# EAGLE design UmnitsaUltrasonic (EAGLE 9.3.0)
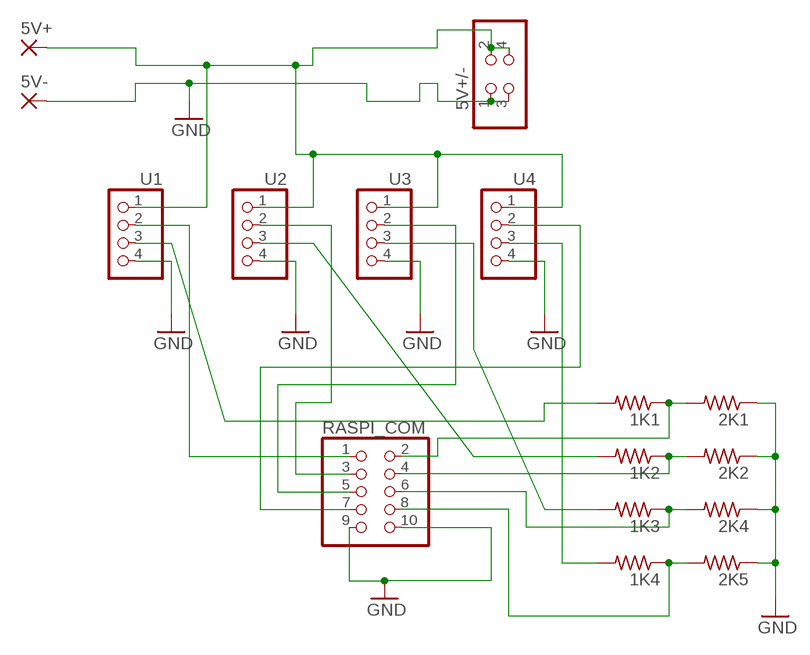
[diagram p0: schematic, sheet 1]

## Parts
1K1  R-US_0204/7  [0204/7]
1K2  R-US_0204/7  [0204/7]
1K3  R-US_0204/7  [0204/7]
1K4  R-US_0204/7  [0204/7]
2K1  R-US_0204/7  [0204/7]
2K2  R-US_0204/7  [0204/7]
2K4  R-US_0204/7  [0204/7]
2K5  R-US_0204/7  [0204/7]
5V+  3,17/1,3  [3,17/1,3]
5V+/-  PINHD-2X2  [2X02]
5V-  3,17/1,3  [3,17/1,3]
RASPI_COM  PINHD-2X5  [2X05]
U1  PINHD-1X4  [1X04]
U2  PINHD-1X4  [1X04]
U3  PINHD-1X4  [1X04]
U4  PINHD-1X4  [1X04]

## Nets
GND [Power]: 2K1.1 2K2.1 2K4.1 2K5.1 5V+/-.1 5V+/-.3 5V-.1(P) RASPI_COM.9 RASPI_COM.10 U1.4 U2.4 U3.4 U4.4
N$1: 1K4.2 U4.3
N$2: 1K3.2 U3.3
N$3: 1K1.1 2K1.2 RASPI_COM.2
N$4: 1K2.1 2K2.2 RASPI_COM.4
N$5: 1K3.1 2K4.2 RASPI_COM.6
N$6 [Power]: 5V+.1(P) 5V+/-.2 5V+/-.4 U1.1 U2.1 U3.1 U4.1
N$7: 1K4.1 2K5.2 RASPI_COM.8
N$8: RASPI_COM.1 U1.2
N$9: RASPI_COM.3 U2.2
N$10: RASPI_COM.5 U3.2
N$11: RASPI_COM.7 U4.2
N$12: 1K2.2 U2.3
N$13: 1K1.2 U1.3

## Library data of the parts
1K1-1K4 2K1 2K2 2K4 2K5 = resistor:R-US_: RESISTOR, American symbol
5V+ 5V- = wirepad:3,17/1,3: THROUGH-HOLE PAD
5V+/- = pinhead:PINHD-2X2: PIN HEADER
RASPI_COM = pinhead:PINHD-2X5: PIN HEADER
U1-U4 = pinhead:PINHD-1X4: PIN HEADER

## Net classes
0 default: width 0.406 mm, clearance 0.457 mm
1 Power: width 1.016 mm, clearance 0.457 mm

## Board
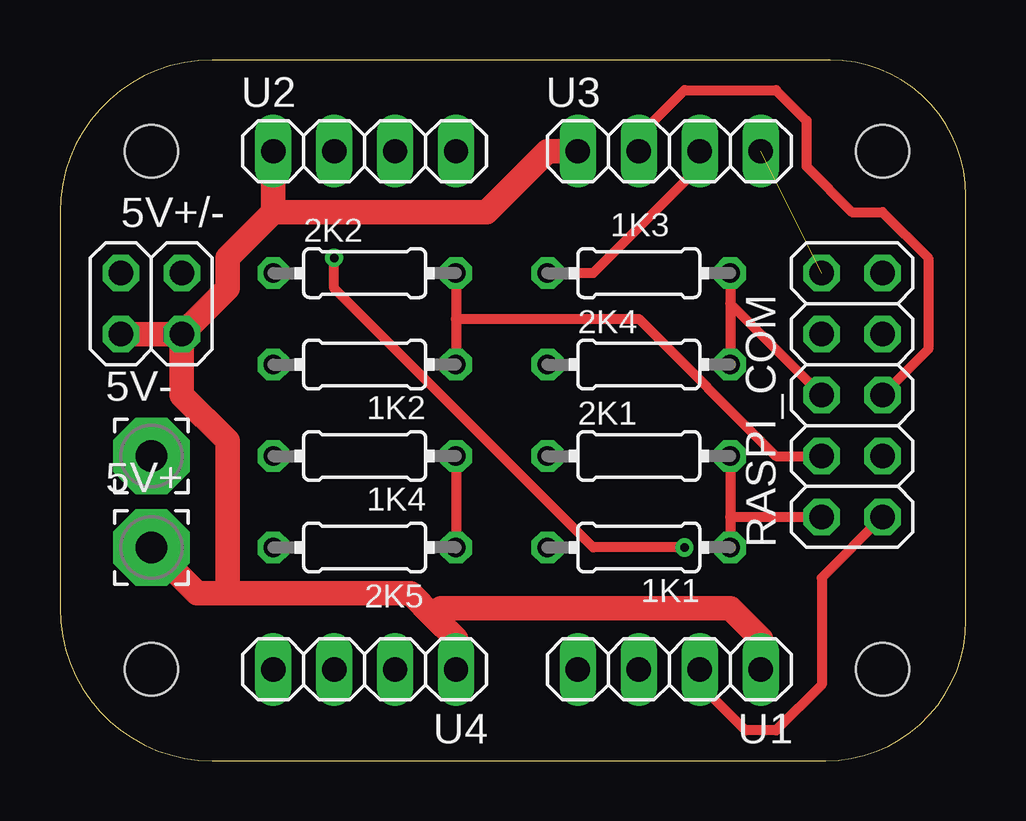
[diagram p1: board, top side]
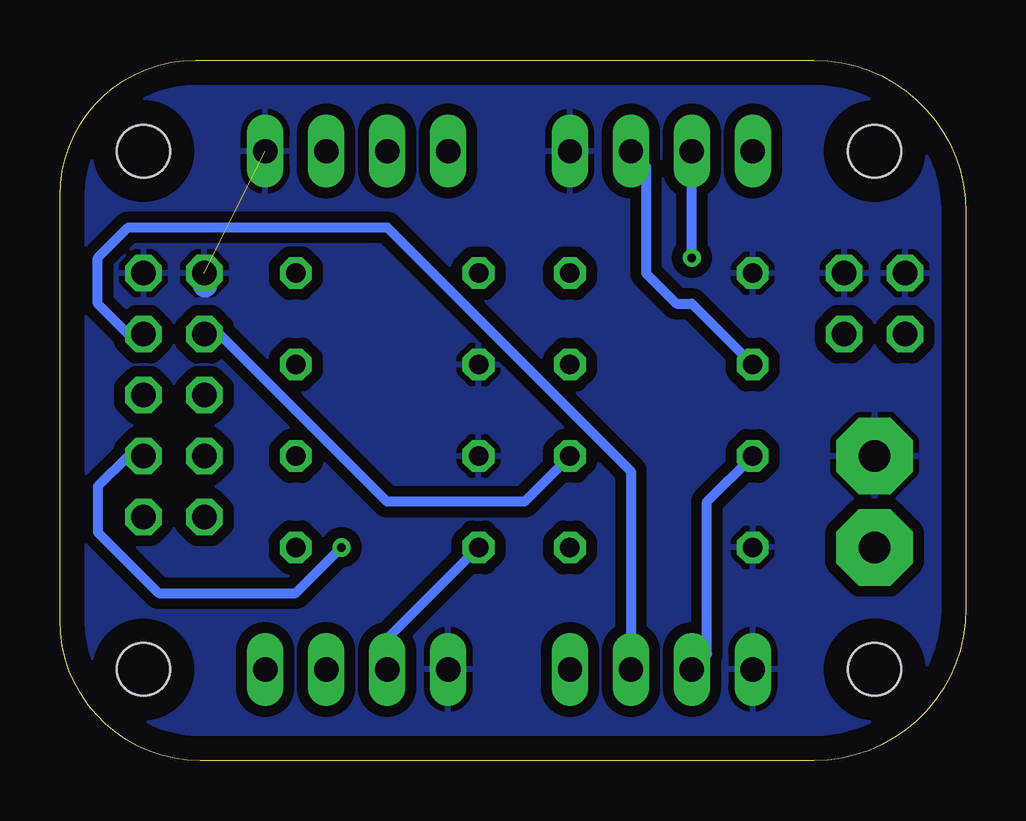
[diagram p2: board, bottom side, seen from below]

Size 37.77 x 29.2 mm. Coordinates in mm from the lower left corner, seen from the top.
Outline: 0,22.87 0,6.35 arc90 6.35,0 31.92,0 arc90 37.77,5.85 37.77,23.55 arc90 32.12,29.2 6.34,29.2 arc90 0,22.87
Copper layers (1*16): Top 0.035mm / dielectric 1.5mm / Bottom 0.035mm
Design rules "default": minimum track width 6mil, minimum drill 0.35mm, track to track 6mil, track to pad 6mil, pad to pad 6mil, via to via 6mil, smd to smd 6mil, copper to edge 40mil, drill to drill 6mil, minimum pad ring 10mil, minimum via ring 8mil, stop-mask expansion 4mil, vias tented up to drill 0mil, thermal gap 10mil
Holes 2.2 mm at 3.81,3.81 3.81,25.4 34.29,3.81 34.29,25.4

### Footprints (pad centres in the part's own frame; a part is rotated, then mirrored left to right if it is on the bottom)
0204/7 = drill 0.813 octagon: 1 -3.81,0; 2 3.81,0
3,17/1,3 = drill 1.321 pad 3.175 octagon: 1 0,0
2X02 = drill 1.016 octagon: 1 -1.27,-1.27; 2 -1.27,1.27; 3 1.27,-1.27; 4 1.27,1.27
2X05 = drill 1.016 octagon: 1 -5.08,-1.27; 2 -5.08,1.27; 3 -2.54,-1.27; 4 -2.54,1.27; 5 0,-1.27; 6 0,1.27; 7 2.54,-1.27; 8 2.54,1.27; 9 5.08,-1.27; 10 5.08,1.27
1X04 = drill 1.016 long: 1 -3.81,0; 2 -1.27,0; 3 1.27,0; 4 3.81,0

### Placement (x,y rotation side)
1K1  24.13,8.89 180 top
1K2  12.7,16.51 180 top
1K3  24.13,20.32 180 top
1K4  12.7,12.7 180 top
2K1  24.13,12.7 0 top
2K2  12.7,20.32 0 top
2K4  24.13,16.51 0 top
2K5  12.7,8.89 0 top
5V+  3.81,8.89 0 top
5V+/-  3.81,19.05 180 top
5V-  3.81,12.7 0 top
RASPI_COM  33.02,15.24 90 top
U1  25.4,3.81 180 top
U2  12.7,25.4 0 top
U3  25.4,25.4 0 top
U4  12.7,3.81 180 top

### Tracks (layer width: path | path; a pad name or v marks a point on that pad's centre or on a via)
GND  (1 unrouted)
  Bottom 1.016: 31.71,19.82 RASPI_COM.10
  pour Bottom (isolate 0.457): 31.75,0 6.35,0 arc-90 0,6.35 0,22.86 arc-90 6.35,29.21 31.75,29.21 arc-90 38.1,22.86 38.1,6.35 arc-90
N$1
  Bottom 0.406: 1K4.2 10.79,10.8 10.79,4.45 U4.3
N$2
  Top 0.406: 1K3.2 22.22,20.32 26.67,24.76 U3.3
N$3
  Top 0.406: 2K1.2 27.94,10.16 | 27.94,10.16 1K1.1 | 27.94,10.16 RASPI_COM.2
N$4
  Top 0.406: 2K2.2 16.51,18.41 | 16.51,18.41 1K2.1 | RASPI_COM.4 29.84,12.7 24.13,18.41 16.51,18.41
N$5
  Top 0.406: 1K3.1 27.94,19.05 | 27.94,19.05 2K4.2 | 27.94,19.05 RASPI_COM.6
N$6
  Top 1.016: 5V+/-.2 5V+/-.4 | 8.89,22.86 U2.1 | 8.89,22.86 6.98,20.96 6.98,19.68 5V+/-.2 | U3.1 20.32,25.4 17.78,22.86 8.89,22.86 | U4.1 16.51,5.08 15.56,6.03 | 15.56,6.03 14.61,6.98 6.98,6.98 | 6.98,6.98 5.71,6.98 5V+.1 | U1.1 29.21,5.08 27.94,6.35 15.88,6.35 15.56,6.03 | 5V+/-.2 5.08,15.24 6.98,13.34 6.98,6.98
N$7
  Top 0.406: 1K4.1 2K5.2
  Bottom 0.406: RASPI_COM.8 31.11,17.78 24.13,10.8 18.41,10.8 1K4.1
N$8
  Top 0.406: U1.2 26.67,3.17 28.57,1.27 29.84,1.27 31.75,3.17 31.75,7.62 RASPI_COM.1
N$9  (via drill 0.35)
  Top 0.406: v11.43,20.96 11.43,19.68 22.22,8.89 v26.04,8.89
  Bottom 0.406: v11.43,20.96 U2.2 | v26.04,8.89 27.94,6.98 33.66,6.98 36.2,9.52 36.2,11.43 34.93,12.7 RASPI_COM.3
N$10
  Top 0.406: RASPI_COM.5 36.2,17.15 36.2,20.96 34.29,22.86 33.02,22.86 31.11,24.76 31.11,26.67 29.84,27.94 26.04,27.94 24.13,26.04 U3.2
N$11
  Bottom 0.406: U4.2 13.97,12.07 24.13,22.23 34.93,22.23 36.2,20.96 36.2,19.05 34.93,17.78 RASPI_COM.7
N$12
  Bottom 0.406: 1K2.2 11.43,19.05 12.06,19.05 13.33,20.32 13.33,24.76 U2.3
N$13
  Bottom 0.406: 1K1.2 24.13,5.08 U1.3